# EAGLE design sonar-breakout (EAGLE 6.4)
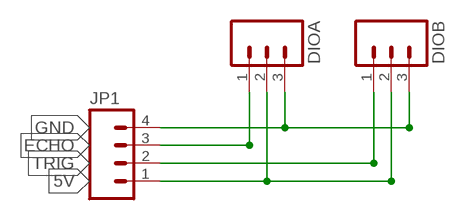
[diagram p0: schematic, sheet 1]

## Parts
DIOA  M03LOCK  [1X03_LOCK]
DIOB  M03LOCK  [1X03_LOCK]
JP1  M04LOCK  [1X04_LOCK]

## Nets
5V: DIOA.2 DIOB.2 JP1.1
ECHO: DIOA.1 JP1.3
GND: DIOA.3 DIOB.3 JP1.4
TRIG: DIOB.1 JP1.2

## Library data of the parts
DIOA DIOB = SparkFun-Connectors:M03: Header 3 Standard 3-pin 0.1" header. Use with straight break away headers (SKU : PRT-00116), right angle break away headers (PRT-00553), swiss pins (PRT-00743), machine pins (PRT-00117), and female headers (PRT-00115). Molex polarized connector foot print use with SKU : PRT-08232 with associated crimp pins and housings.
JP1 = SparkFun-Connectors:M04: Header 4 Standard 4-pin 0.1" header. Use with straight break away headers (SKU : PRT-00116), right angle break away headers (PRT-00553), swiss pins (PRT-00743), machine pins (PRT-00117), and female headers (PRT-00115). Molex polarized connector foot print use with SKU : PRT-08231 with associated crimp pins and housings. 1MM SMD Version SKU: PRT-10208

## Board
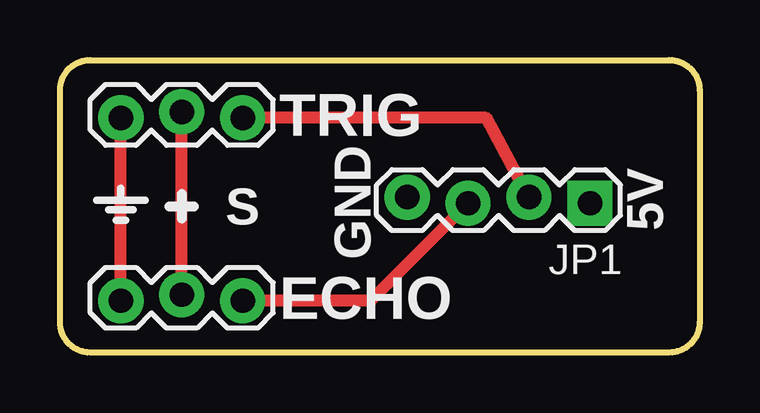
[diagram p1: board, top side]
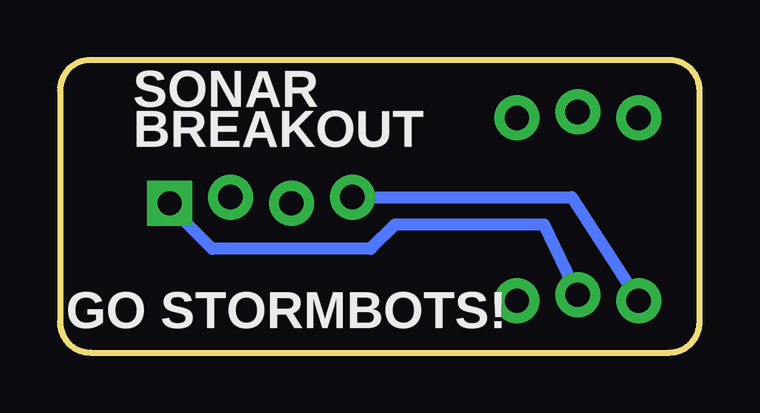
[diagram p2: board, bottom side, seen from below]

Size 26.67 x 12.19 mm. Coordinates in mm from the lower left corner, seen from the top.
Outline: 1.27,12.19 25.4,12.19 arc-90 26.67,10.92 26.67,1.27 arc-90 25.4,0 1.27,0 arc-90 0,1.27 0,10.92 arc-90 1.27,12.19
Copper layers (1*16): Top 0.035mm / dielectric 1.5mm / Bottom 0.035mm
Design rules "default": minimum track width 10mil, minimum drill 0.6mm, track to track 8mil, track to pad 8mil, pad to pad 8mil, via to via 8mil, smd to smd 8mil, copper to edge 40mil, drill to drill 8mil, minimum pad ring 10mil, minimum via ring 8mil, stop-mask expansion 4mil, vias tented up to drill 0mil, thermal gap 10mil

### Footprints (pad centres in the part's own frame; a part is rotated, then mirrored left to right if it is on the bottom)
1X03_LOCK = drill 1.016 pad 1.88: 1 0,0.127; 2 2.54,-0.127; 3 5.08,0.127
1X04_LOCK = drill 1.016 pad 1.88 square: 1 0,0.127 | drill 1.016 pad 1.88: 2 2.54,-0.127; 3 5.08,0.127; 4 7.62,-0.127

### Placement (x,y rotation side)
DIOA  7.62,2.29 180 top
DIOB  7.62,9.91 180 top
JP1  22.1,6.35 180 top

### Tracks (layer width: path | path; a pad name or v marks a point on that pad's centre or on a via)
5V
  Top 0.508: DIOA.2 DIOB.2
  Bottom 0.508: DIOA.2 6.48,5.33 12.7,5.33 13.72,4.32 20.32,4.32 22.1,6.1 JP1.1
ECHO
  Top 0.508: JP1.3 12.95,2.16 DIOA.1
GND
  Top 0.508: DIOA.3 DIOB.3
  Bottom 0.508: JP1.4 5.33,6.48 DIOA.3
TRIG
  Top 0.508: JP1.2 17.78,9.78 DIOB.1

### Text on the board
tPlace: TRIG | GND | S | 5V | ECHO
bPlace: SONAR / BREAKOUT | GO STORMBOTS!